# EAGLE design R405X (EAGLE 6.6.0)
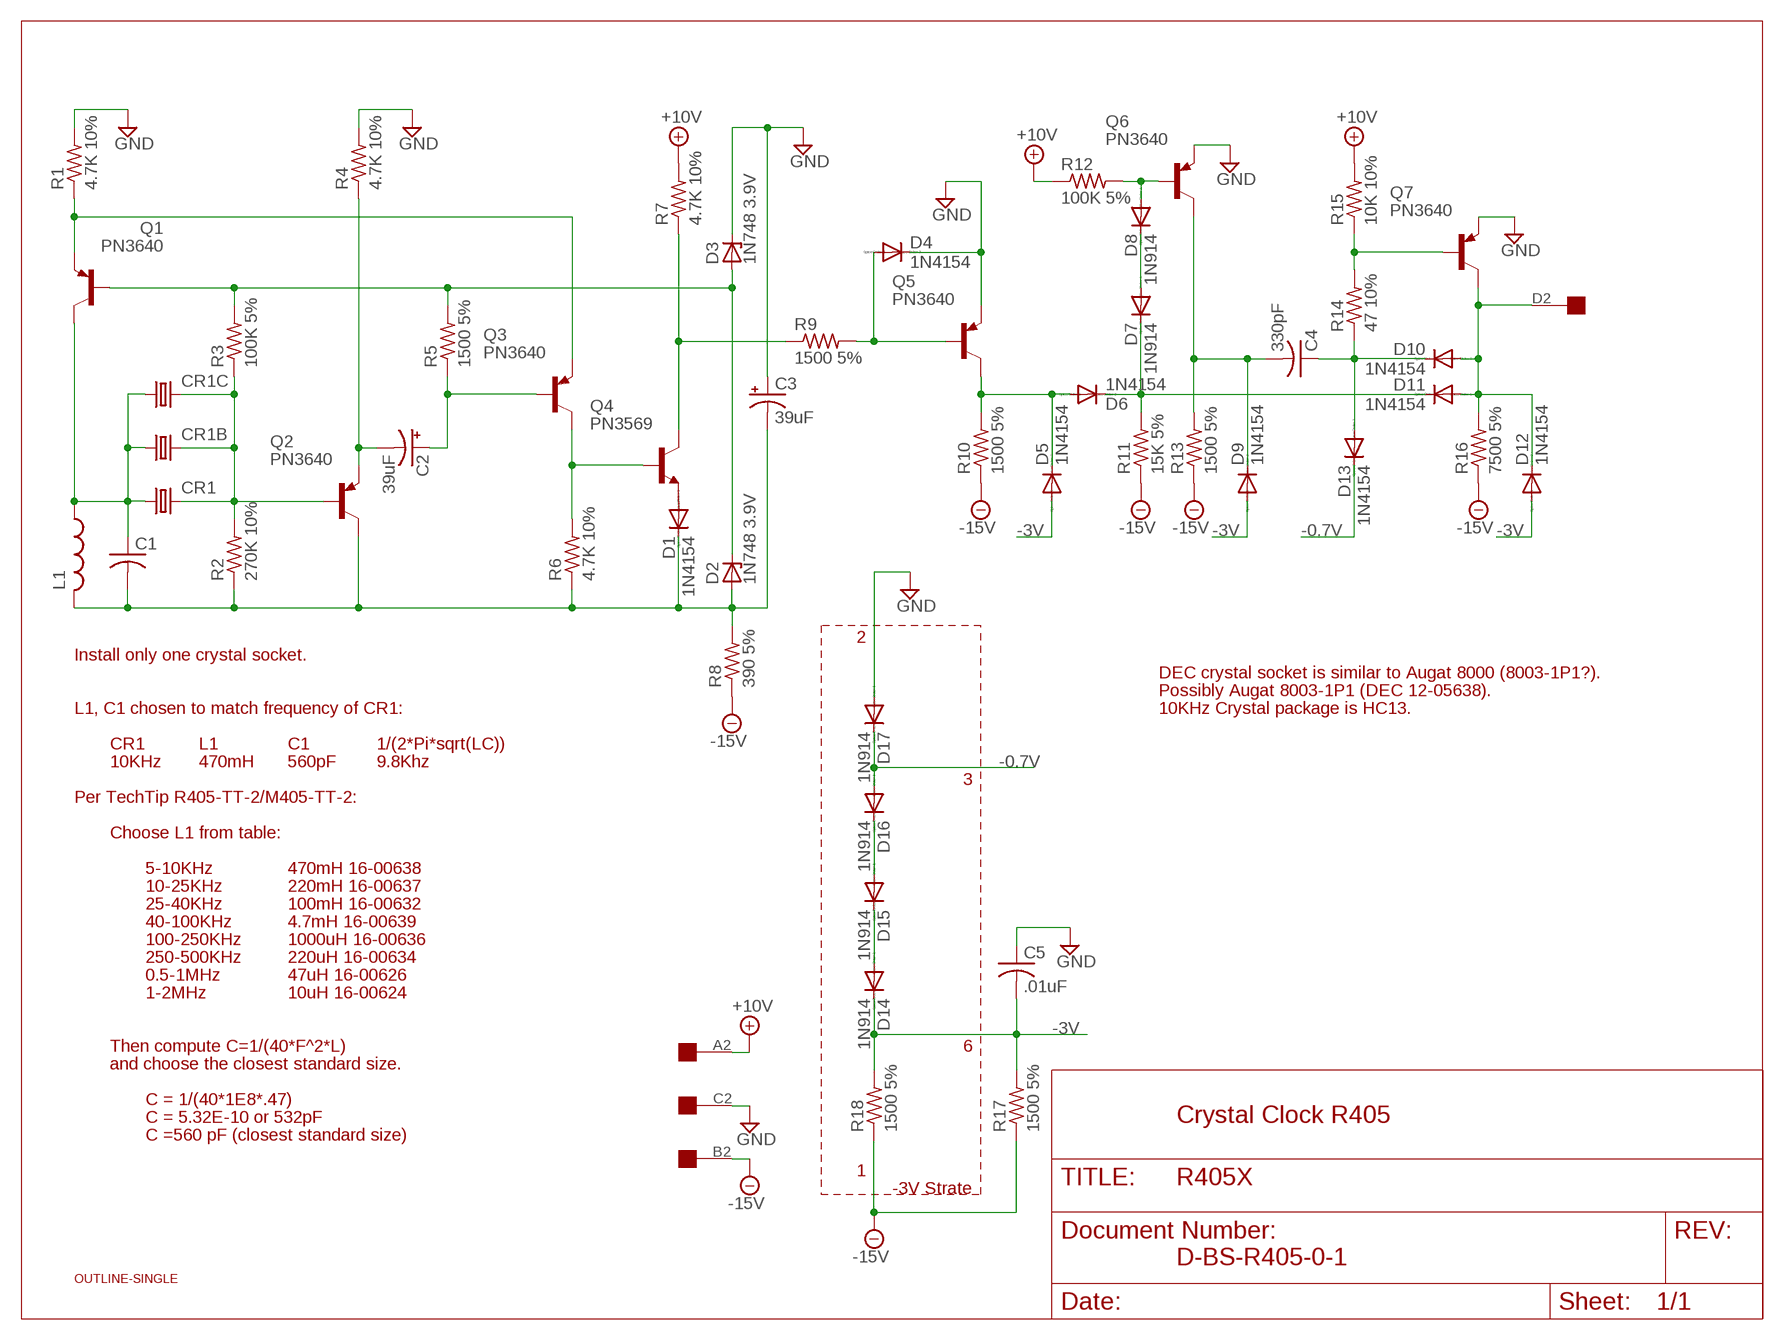
[diagram p0: schematic, sheet 1]

## Parts
C1  C-US150-054X183  [C150-054X183]
C2  39uF  CPOL-USE15-5AXIAL  [E15-5]
C3  39uF  CPOL-USE15-5AXIAL  [E15-5]
C4  330pF  C-US150-054X183  [C150-054X183]
C5  .01uF  C-US150-054X183  [C150-054X183]
CR1  CRYSTALHC13U-H  [HC13U-H]
CR1B  CRYSTALSMALL  [AUG8004]
CR1C  CRYSTALBIG  [AUG8000]
D1  1N4154  1N4148DO35-10  [DO35-10]
D2  1N748 3.9V  ZENER-DIODEDO35Z10  [DO35Z10]
D3  1N748 3.9V  ZENER-DIODEDO35Z10  [DO35Z10]
D4  1N4154  1N4148DO35-10  [DO35-10]
D5  1N4154  1N4148DO35-10  [DO35-10]
D6  1N4154  1N4148DO35-10  [DO35-10]
D7  1N914  1N4148DO35-10  [DO35-10]
D8  1N914  1N4148DO35-10  [DO35-10]
D9  1N4154  1N4148DO35-10  [DO35-10]
D10  1N4154  1N4148DO35-10  [DO35-10]
D11  1N4154  1N4148DO35-10  [DO35-10]
D12  1N4154  1N4148DO35-10  [DO35-10]
D13  1N4154  1N4148DO35-10  [DO35-10]
D14  1N914  1N4148DO35-10  [DO35-10]
D15  1N914  1N4148DO35-10  [DO35-10]
D16  1N914  1N4148DO35-10  [DO35-10]
D17  1N914  1N4148DO35-10  [DO35-10]
L1  L-US0207/7  [0207/7]
Q1  PN3640  2N2904  [TO39]
Q2  PN3640  2N2904  [TO39]
Q3  PN3640  2N2904  [TO39]
Q4  PN3569  2N2102  [TO5]
Q5  PN3640  2N2904  [TO39]
Q6  PN3640  2N2904  [TO39]
Q7  PN3640  2N2904  [TO39]
R1  4.7K 10%  R-US_0207/10  [0207/10]
R2  270K 10%  R-US_0207/10  [0207/10]
R3  100K 5%  R-US_0207/10  [0207/10]
R4  4.7K 10%  R-US_0207/10  [0207/10]
R5  1500 5%  R-US_0207/10  [0207/10]
R6  4.7K 10%  R-US_0207/10  [0207/10]
R7  4.7K 10%  R-US_0207/10  [0207/10]
R8  390 5%  R-US_0207/10  [0207/10]
R9  1500 5%  R-US_0207/10  [0207/10]
R10  1500 5%  R-US_0207/10  [0207/10]
R11  15K 5%  R-US_0207/10  [0207/10]
R12  100K 5%  R-US_0207/10  [0207/10]
R13  1500 5%  R-US_0207/10  [0207/10]
R14  47 10%  R-US_0207/10  [0207/10]
R15  10K 10%  R-US_0207/10  [0207/10]
R16  7500 5%  R-US_0207/10  [0207/10]
R17  1500 5%  R-US_0207/10  [0207/10]
R18  1500 5%  R-US_0207/10  [0207/10]
U$1  OUTLINE-SINGLE  [SINGLE]
U$2  EDGE-1  [EDGE-CON1]

## Nets
+10V [Supply]: R7.2 R12.1 R15.2 U$2.A2
-0.7V [Supply]: D13.C D16.A D17.C
-3V [Supply]: C5.2 D5.A D9.A D12.A D14.C R17.2 R18.2
-15V [Supply]: R8.1 R10.1 R11.1 R13.1 R16.1 R17.1 R18.1 U$2.B2
GND [Supply]: C3.+ C5.1 D3.C D4.C D17.A Q5.1(E) Q6.1(E) Q7.1(E) R1.2 R4.2 U$2.C2
N$1: Q1.1(E) Q3.1(E) R1.1
N$2: C1.1 CR1.1 CR1B.1 CR1C.1 L1.1 Q1.3(C)
N$3: C1.2 C3.- D1.C D2.A L1.2 Q2.3(C) R2.1 R6.1 R8.2
N$4: C2.- Q2.1(E) R4.1
N$5: D1.A Q4.1(E)
N$6: CR1.2 CR1B.2 CR1C.2 Q2.2(B) R2.2 R3.1
N$7: D2.C D3.A Q1.2(B) R3.2 R5.2
N$8 [Supply]: D15.A D16.C
N$9 [Supply]: D14.A D15.C
N$10: C2.+ Q3.2(B) R5.1
N$11: Q3.3(C) Q4.2(B) R6.2
N$12: Q4.3(C) R7.1 R9.1
N$13: D4.A Q5.2(B) R9.2
N$14: D5.C D6.A Q5.3(C) R10.2
N$15: D8.A Q6.2(B) R12.2
N$16: D7.A D8.C
N$17: D6.C D7.C D11.C R11.2
N$18: C4.2 D9.C Q6.3(C) R13.2
N$19: C4.1 D10.C D13.A R14.1
N$20: Q7.2(B) R14.2 R15.1
N$21: D10.A D11.A D12.C Q7.3(C) R16.2 U$2.D2
Unconnected: U$2.E2 U$2.F2 U$2.H2 U$2.J2 U$2.K2 U$2.L2 U$2.M2 U$2.N2 U$2.P2 U$2.R2 U$2.S2 U$2.T2 U$2.U2 U$2.V2

## Notes on the sheet
- 2
- Install only one crystal socket.
- DEC crystal socket is similar to Augat 8000 (8003-1P1?).
- Possibly Augat 8003-1P1 (DEC 12-05638).
- L1, C1 chosen to match frequency of CR1: | 10KHz Crystal package is HC13.
- CR1 | L1 | C1 | 1/(2*Pi*sqrt(LC))
- 10KHz | 470mH | 560pF | 9.8Khz
- 3
- Per TechTip R405-TT-2/M405-TT-2:
- Choose L1 from table:
- 5-10KHz | 470mH 16-00638
- 10-25KHz | 220mH 16-00637
- 25-40KHz | 100mH 16-00632
- 40-100KHz | 4.7mH 16-00639
- 100-250KHz | 1000uH 16-00636
- 250-500KHz | 220uH 16-00634
- 0.5-1MHz | 47uH 16-00626
- 1-2MHz | 10uH 16-00624
- Then compute C=1/(40*F^2*L) | 6
- and choose the closest standard size.
- C = 1/(40*1E8*.47)
- C = 5.32E-10 or 532pF | Crystal Clock R405
- C =560 pF (closest standard size)
- 1
- -3V Strate
- D-BS-R405-0-1

## Library data of the parts
C1 C4 C5 = rcl:C-US: CAPACITOR, American symbol
C2 C3 = rcl:CPOL-US: POLARIZED CAPACITOR, American symbol
CR1 = crystal:CRYSTAL: CRYSTAL; OC_FARNELL: unknown; OC_NEWARK: unknown
CR1B CR1C = dec-con:CRYSTAL
D1 D4-D17 = diode:1N4148: DIODE high speed (Philips)
D2 D3 = diode:ZENER-DIODE: Z-Diode
L1 = rcl:L-US: INDUCTOR, American symbol
Q1-Q3 Q5-Q7 = transistor-pnp:2N2904*: PNP Transistror
Q4 = transistor-npn:2N2102: NPN Transistor
R1-R18 = rcl:R-US_: RESISTOR, American symbol
U$1 = dec-con:OUTLINE-*: Board outlines for DEC boards.
U$2 = dec-con:EDGE-1: Single-Sided DEC Edge Connector -- (side 2)

## Net classes
1 Supply: width 0.813 mm

## Board
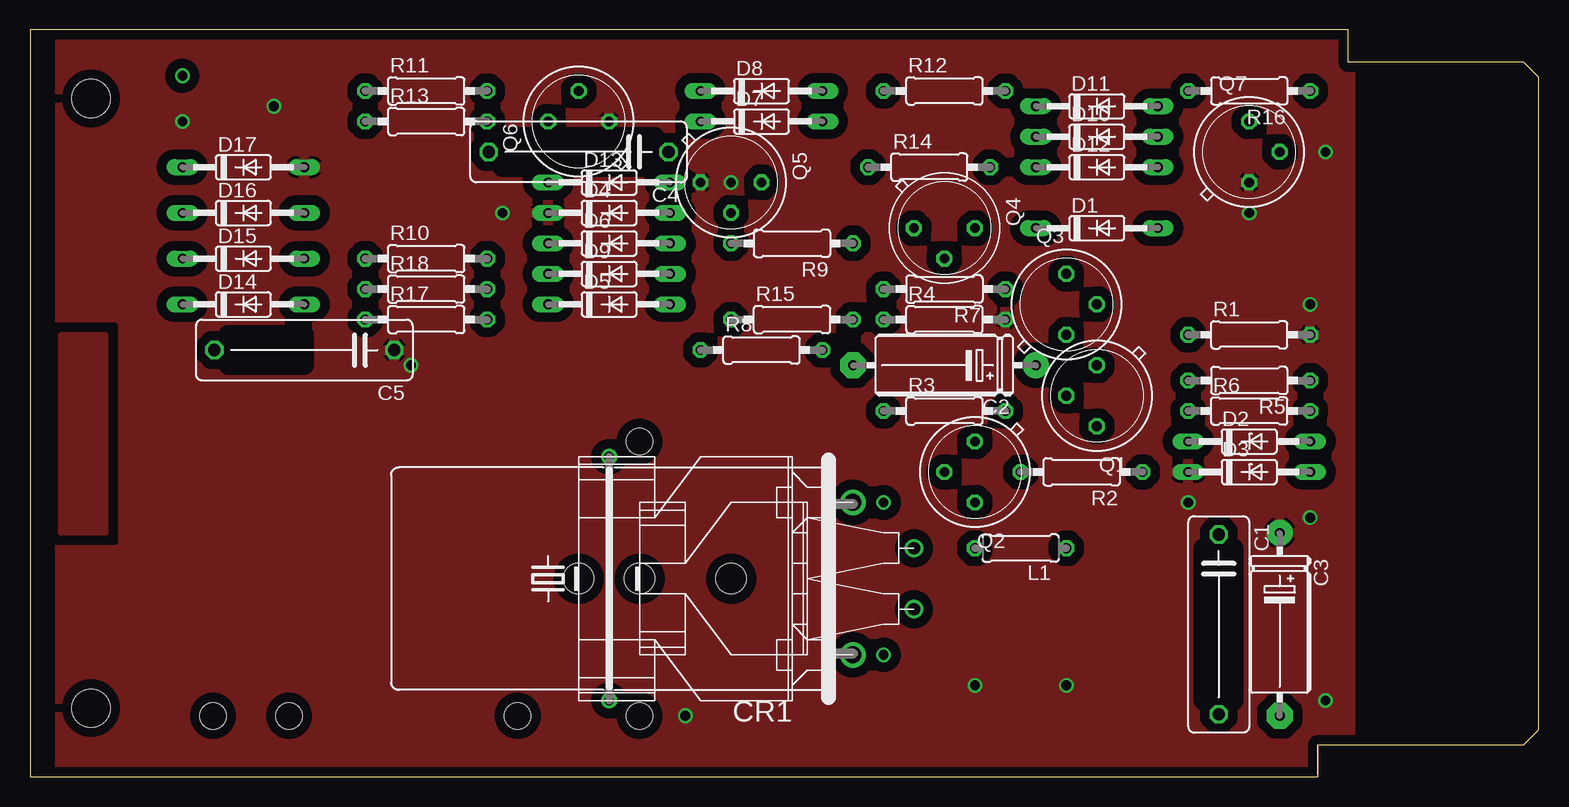
[diagram p1: board, top side]
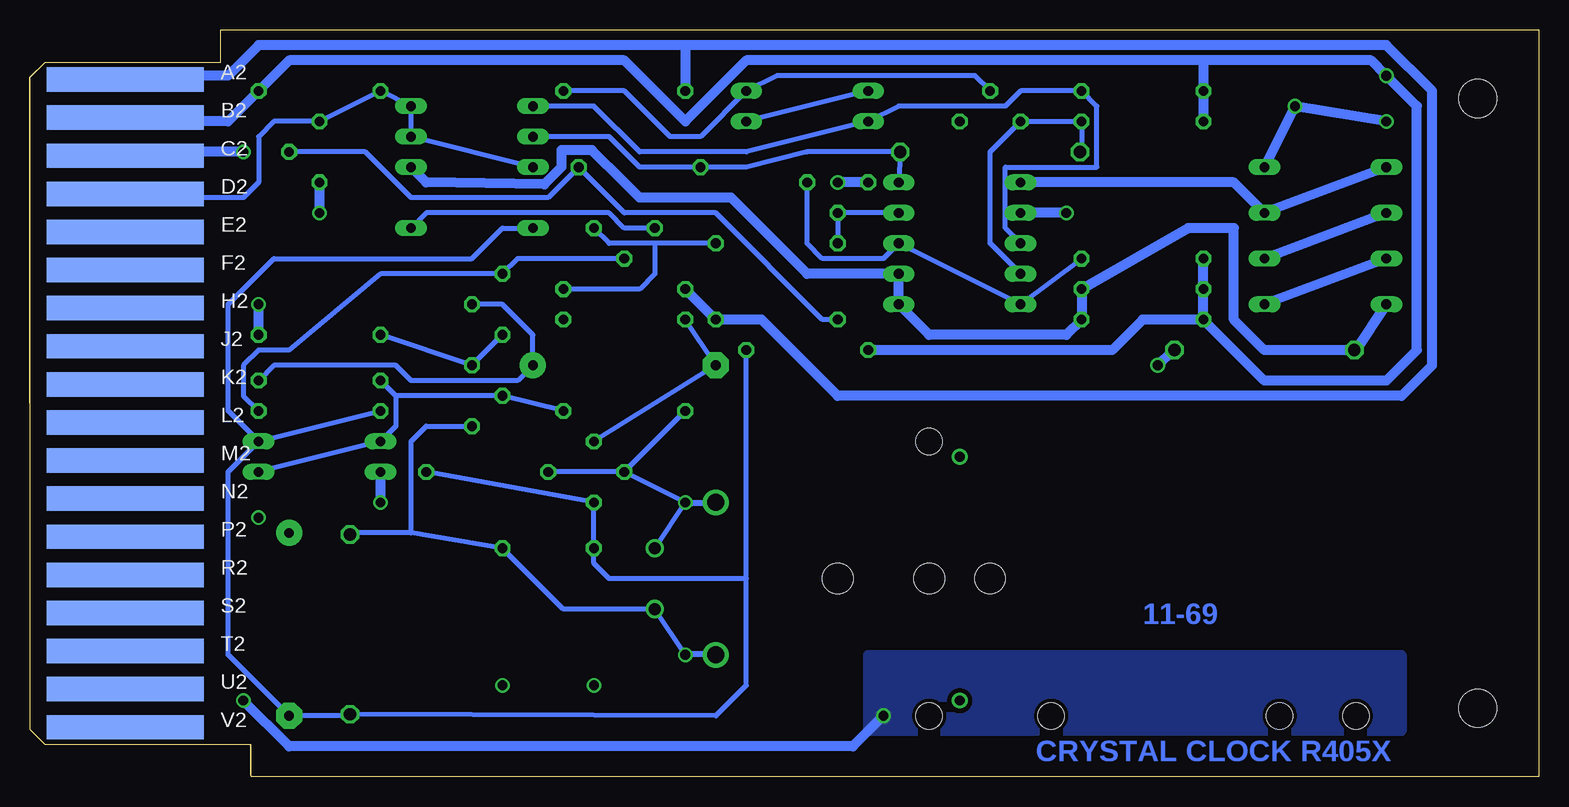
[diagram p2: board, bottom side, seen from below]

Size 125.73 x 62.23 mm. Coordinates in mm from the lower left corner, seen from the top.
Copper layers (1+16): Top 0.035mm / dielectric 1.5mm / Bottom 0.035mm
Design rules "16mils": minimum track width 16mil, minimum drill 32mil, track to track 15mil, track to pad 10mil, pad to pad 10mil, via to via 10mil, smd to smd 10mil, copper to edge 13mil, drill to drill 10mil, minimum pad ring 10mil, minimum via ring 8mil, stop-mask expansion 0mil, vias tented up to drill 0mil, thermal gap 10mil
Holes 2.18 mm at 15.24,5.08 21.59,5.08 40.64,5.08 50.8,5.08 50.8,27.94
tRestrict: area 16.5,34.3 to 22.9,36.8; area 39.4,50.8 to 45.7,53.3; area 45.7,50.8 to 52.1,53.3; area 97.8,6.4 to 100.3,12.7; area 97.8,12.7 to 100.3,19

### Footprints (pad centres in the part's own frame; a part is rotated, then mirrored left to right if it is on the bottom)
C150-054X183 = drill 1.016 octagon: 1 -7.493,0; 2 7.493,0
E15-5 = drill 0.813 pad 2.159: + -7.62,0 | drill 0.813 pad 2.159 octagon: - 7.62,0
HC13U-H = drill 1.016: 1 -6.223,-5.08; 2 6.223,-5.08 | drill 0.813: M -10.16,15.24; M1 10.16,15.24
AUG8004 = drill 1.016: 1 -5.08,2.54; 2 -5.08,-2.54 | hole 2.54: 10.16,0; 17.78,0
AUG8000 = drill 1.422: 1 0,6.35; 2 0,-6.35 | hole 2.54: 10.16,0; 17.78,0; 22.86,0
DO35-10 = drill 0.813 long: A 5.08,0; C -5.08,0
DO35Z10 = drill 0.813 long: A 5.08,0; C -5.08,0
0207/7 = drill 0.813 octagon: 1 -3.81,0; 2 3.81,0
TO39 = drill 0.813 octagon: 1 0,-2.54; 2 2.54,0; 3 0,2.54
TO5 = drill 0.813 octagon: 1 0,-2.54; 2 2.54,0; 3 0,2.54
0207/10 = drill 0.813 octagon: 1 -5.08,0; 2 5.08,0
SINGLE = hole 3.175: 120.65,56.515; 120.65,5.715
EDGE-CON1 = smd 13.106 x 2.032 bottom: A2 7.938,4.128; B2 7.938,7.303; C2 7.938,10.477; D2 7.938,13.652; E2 7.938,16.828; F2 7.938,20.003; H2 7.938,23.177; J2 7.938,26.352; K2 7.938,29.527; L2 7.938,32.703; M2 7.938,35.877; N2 7.938,39.053; P2 7.938,42.227; R2 7.938,45.403; S2 7.938,48.578; T2 7.938,51.752; U2 7.938,54.928; V2 7.938,58.102

### Placement (x,y rotation side)
C1  99.06,12.7 270 top
C2  76.2,34.29 180 top
C3  104.14,12.7 270 top
C4  45.72,52.07 180 top
C5  22.86,35.56 180 top
CR1  63.5,16.51 90 top
CR1B  68.58,16.51 180 top
CR1C  68.58,16.51 180 top
D1  88.9,45.72 0 top
D2  101.6,27.94 0 top
D3  101.6,25.4 0 top
D4  48.26,46.99 0 top
D5  48.26,39.37 0 top
D6  48.26,44.45 0 top
D7  60.96,54.61 0 top
D8  60.96,57.15 0 top
D9  48.26,41.91 0 top
D10  88.9,53.34 0 top
D11  88.9,55.88 0 top
D12  88.9,50.8 0 top
D13  48.26,49.53 0 top
D14  17.78,39.37 0 top
D15  17.78,43.18 0 top
D16  17.78,46.99 0 top
D17  17.78,50.8 0 top
L1  82.55,19.05 180 top
Q1  88.9,31.75 180 top
Q2  78.74,25.4 180 top
Q3  86.36,39.37 0 top
Q4  76.2,45.72 270 top
Q5  58.42,49.53 270 top
Q6  45.72,54.61 90 top
Q7  101.6,52.07 0 top
R1  101.6,36.83 0 top
R2  87.63,25.4 180 top
R3  76.2,30.48 0 top
R4  76.2,38.1 0 top
R5  101.6,33.02 180 top
R6  101.6,30.48 0 top
R7  76.2,40.64 180 top
R8  60.96,35.56 0 top
R9  63.5,44.45 180 top
R10  33.02,43.18 0 top
R11  33.02,57.15 0 top
R12  76.2,57.15 0 top
R13  33.02,54.61 0 top
R14  74.93,50.8 0 top
R15  63.5,38.1 0 top
R16  101.6,57.15 180 top
R17  33.02,38.1 0 top
R18  33.02,40.64 0 top
U$1  125.73,62.23 180 top
U$2  125.73,62.23 180 top

### Tracks (layer width: path | path; a pad name or v marks a point on that pad's centre or on a via)
+10V
  Bottom 0.813: U$2.A2 116.84,58.42 109.22,58.42 106.68,60.96 71.12,60.96 | 71.12,60.96 R12.1 | 71.12,60.96 12.7,60.96 8.89,57.15 8.89,34.29 11.43,31.75 58.42,31.75 64.77,38.1 R15.2 R7.2
-0.7V
  Bottom 0.813: D17.C D16.A 25.4,49.53 D13.C
-3V
  Bottom 0.813: D12.A 92.71,49.53 82.87,49.37 81.44,50.8 81.44,52.23 78.9,52.23 76.2,49.53 74.93,48.26 67.31,48.26 60.96,41.91 D9.A D5.A 50.8,36.83 39.37,36.83 R17.2 R18.2 29.21,45.72 25.4,45.72 25.4,38.1 22.86,35.56 C5.2 15.24,35.56 D14.C
-15V  (via drill 0.81)
  Bottom 0.813: U$2.B2 116.84,54.61 109.22,54.61 R16.1 104.14,59.69 76.2,59.69 71.12,54.61 66.04,59.69 27.94,59.69 | 27.94,59.69 R11.1 R13.1 | 27.94,59.69 13.97,59.69 v12.7,58.42 10.16,55.88 10.16,35.56 12.7,33.02 22.86,33.02 R17.1 | R10.1 R18.1 R17.1 | R17.1 33.02,38.1 35.56,35.56 R8.1
GND  (via drill 0.81)
  Bottom 0.813: U$2.C2 116.84,52.07 v107.95,52.07 | v101.6,46.99 Q7.1 | v54.61,5.08 57.15,2.54 104.14,2.54 v107.95,6.35 | v12.7,54.61 v20.32,55.88 D17.A | v39.37,46.99 D4.C | R1.2 v106.68,39.37 | v96.52,22.86 D3.C | Q5.1 v58.42,49.53 | v31.75,34.29 30.48,35.56
  other vias: 106.68,21.59 78.74,7.62 86.36,7.62
  pour Top (isolate 0.813, rank 2): 2.54,62.23 111.76,62.23 111.76,0 2.54,0
  pour Bottom: 11.43,10.16 11.43,3.81 55.88,3.81 55.88,10.16
N$1
  Bottom 0.406: Q3.1 Q1.1 R1.1
N$2  (via drill 0.81)
  Bottom 0.406: CR1.1 71.12,10.29 v71.12,10.16 | v71.12,10.16 CR1B.1 81.28,13.97 L1.1 93.98,20.32 | C1.1 99.06,20.32 93.98,20.32 | Q1.3 92.71,29.21 93.98,27.94 93.98,20.32 | CR1C.1 v71.12,10.16
N$3
  Bottom 0.406: 66.04,16.51 R8.2 | 66.04,16.51 77.47,16.51 78.74,17.78 L1.2 Q2.3 R2.1 | 66.04,16.51 66.04,7.62 68.58,5.08 C1.2 99.06,5.08 C3.- 109.22,10.16 109.22,25.4 D2.A | D2.A R6.1 | D1.C 86.36,45.72 88.9,43.18 105.41,43.18 109.22,39.37 109.22,30.48 D2.A
N$4
  Bottom 0.406: Q2.1 C2.- R4.1
N$5
  Bottom 0.406: Q4.1 76.2,45.72 77.47,46.99 92.71,46.99 D1.A
N$6  (via drill 0.81)
  Bottom 0.406: CR1.2 71.12,22.73 v71.12,22.86 | v71.12,22.86 Q2.2 | Q2.2 R2.2 | Q2.2 R3.1 | v71.12,22.86 CR1B.2 | v71.12,22.86 CR1C.2
N$7
  Bottom 0.406: D3.A D2.C 95.25,29.21 95.25,31.75 | 95.25,31.75 R5.2 | 95.25,31.75 Q1.2 R3.2
N$8
  Bottom 0.813: D16.C D15.A
N$9
  Bottom 0.813: D15.C D14.A
N$10
  Bottom 0.406: Q3.2 86.36,39.37 83.82,36.83 C2.+ 85.09,33.02 93.98,33.02 95.25,34.29 105.41,34.29 R5.1
N$11
  Bottom 0.406: Q4.2 85.09,43.18 Q3.3 96.52,41.91 104.14,35.56 106.68,35.56 107.95,34.29 107.95,31.75 R6.2
N$12
  Bottom 0.406: R9.1 73.66,44.45 | 73.66,44.45 77.47,44.45 Q4.3 | R7.1 74.93,40.64 73.66,41.91 73.66,44.45
N$13
  Bottom 0.406: D4.A Q5.2 R9.2
N$14
  Bottom 0.406: R10.2 D5.C D6.A 54.61,43.18 59.69,43.18 60.96,44.45 Q5.3
N$15
  Bottom 0.406: Q6.2 46.99,58.42 63.5,58.42 D8.A 69.85,53.34 72.39,53.34 76.2,57.15 R12.2
N$16
  Bottom 0.406: D8.C D7.A
N$17
  Bottom 0.406: D11.C 78.74,55.88 74.93,52.07 66.04,52.07 D7.C 53.34,55.88 44.45,55.88 43.18,57.15 R11.2 36.83,55.88 36.83,50.8 44.45,50.8 44.45,45.72 D6.C
N$18
  Bottom 0.406: C4.2 38.1,52.07 R13.2 Q6.3 45.72,52.07 45.72,44.45 D9.C
N$19
  Bottom 0.406: D10.C 77.47,53.34 74.93,50.8 R14.1 66.04,50.8 60.96,52.07 C4.1 D13.A
N$20
  Bottom 0.406: Q7.2 97.79,52.07 93.98,48.26 82.55,48.26 R14.2 76.2,46.99 68.58,46.99 59.69,38.1 R15.1
N$21
  Bottom 0.406: U$2.D2 116.84,48.26 107.95,48.26 106.68,49.53 106.68,53.34 105.41,54.61 Q7.3 R16.2 D11.A D10.A D12.C
N$22
  pour Top: 2.54,36.83 2.54,20.32 6.35,20.32 6.35,36.83

### Text on the board
Bottom: 11-69 | CRYSTAL CLOCK R405X
tRestrict: FLIP CHIP